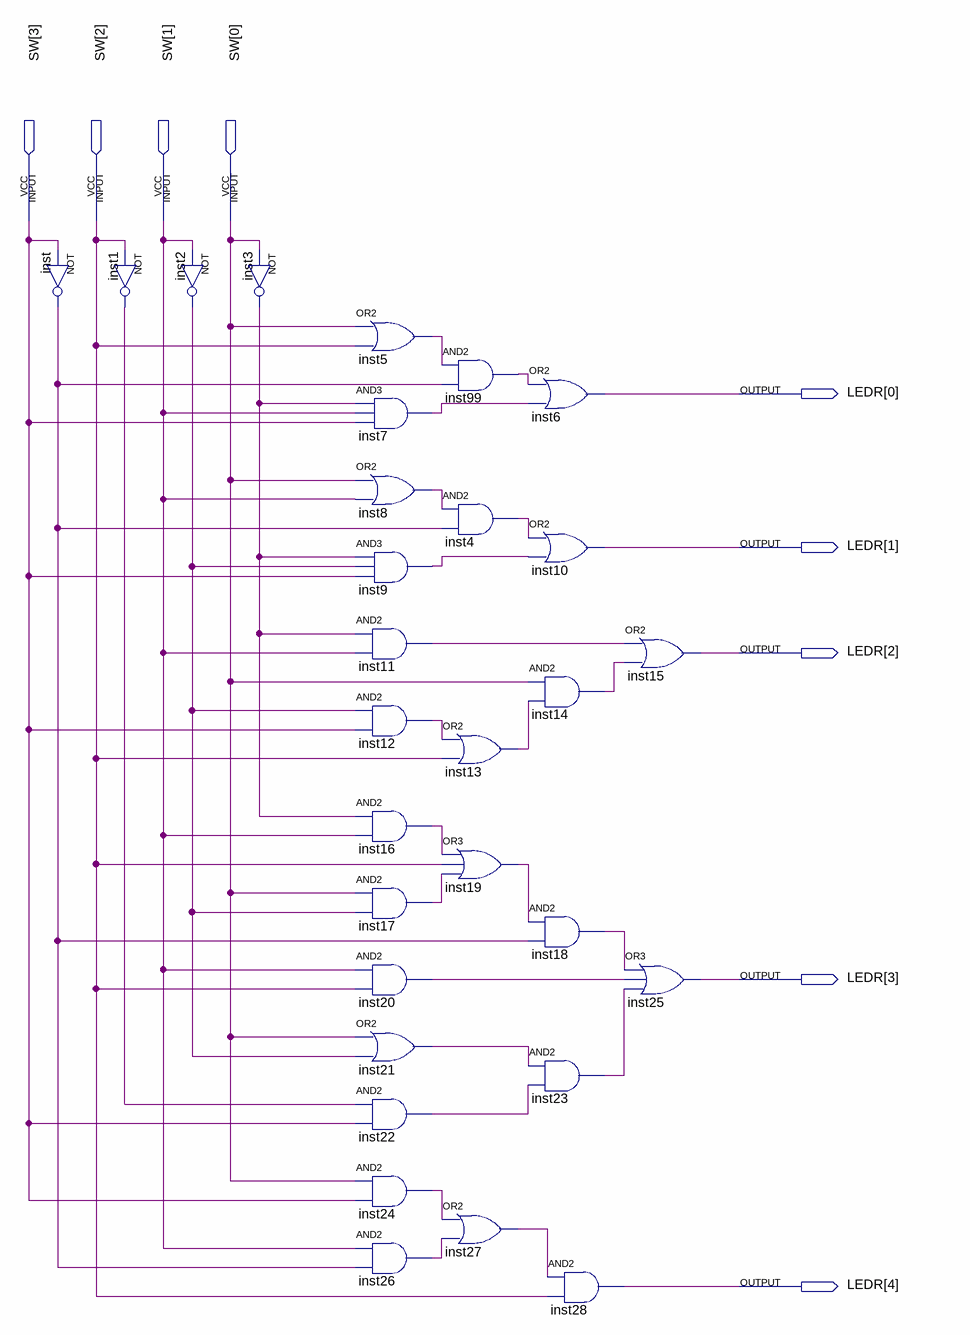
[diagram p0: schematic sheet]
// Quartus schematic transkoder (copy 1).bdf as structural Verilog: 30 symbols, 9 pins
module \transkoder_(copy_1)  (
  input  [3:0] SW,
  output [4:0] LEDR
);

  wire inst1_out, inst2_out, inst3_out, inst4_out, inst5_out, inst7_out, inst8_out, inst9_out, inst11_out,
       inst12_out, inst13_out, inst14_out, inst16_out, inst17_out, inst18_out, inst19_out, inst20_out,
       inst21_out, inst22_out, inst23_out, inst24_out, inst26_out, inst27_out, inst99_out, inst_out;

  not inst (inst_out, SW[3]);
  not inst1 (inst1_out, SW[2]);
  not inst2 (inst2_out, SW[1]);
  not inst3 (inst3_out, SW[0]);
  or inst5 (inst5_out, SW[0], SW[2]);
  and inst7 (inst7_out, inst3_out, SW[1], SW[3]);
  or inst8 (inst8_out, SW[0], SW[1]);
  and inst9 (inst9_out, inst3_out, inst2_out, SW[3]);
  and inst11 (inst11_out, inst3_out, SW[1]);
  and inst12 (inst12_out, inst2_out, SW[3]);
  and inst16 (inst16_out, inst3_out, SW[1]);
  and inst17 (inst17_out, SW[0], inst2_out);
  and inst20 (inst20_out, SW[1], SW[2]);
  or inst21 (inst21_out, SW[0], inst2_out);
  and inst22 (inst22_out, inst1_out, SW[3]);
  and inst24 (inst24_out, SW[0], SW[3]);
  and inst26 (inst26_out, SW[1], inst_out);
  and inst99 (inst99_out, inst5_out, inst_out);
  and inst4 (inst4_out, inst8_out, inst_out);
  or inst13 (inst13_out, inst12_out, SW[2]);
  or inst19 (inst19_out, inst16_out, SW[2], inst17_out);
  or inst27 (inst27_out, inst24_out, inst26_out);
  or inst6 (LEDR[0], inst99_out, inst7_out);
  or inst10 (LEDR[1], inst4_out, inst9_out);
  and inst14 (inst14_out, SW[0], inst13_out);
  and inst18 (inst18_out, inst19_out, inst_out);
  and inst23 (inst23_out, inst21_out, inst22_out);
  and inst28 (LEDR[4], inst27_out, SW[2]);
  or inst15 (LEDR[2], inst11_out, inst14_out);
  or inst25 (LEDR[3], inst18_out, inst20_out, inst23_out);
endmodule
